# EAGLE design RoboDrum_Final (EAGLE 9.6.2)
AUTHOR: Ward, Turn, Gokhale; BOARD_NAME: FinalDraft; DOC_NUM: 0; PROJECT_NAME: RoboDrum; REVISION: 1
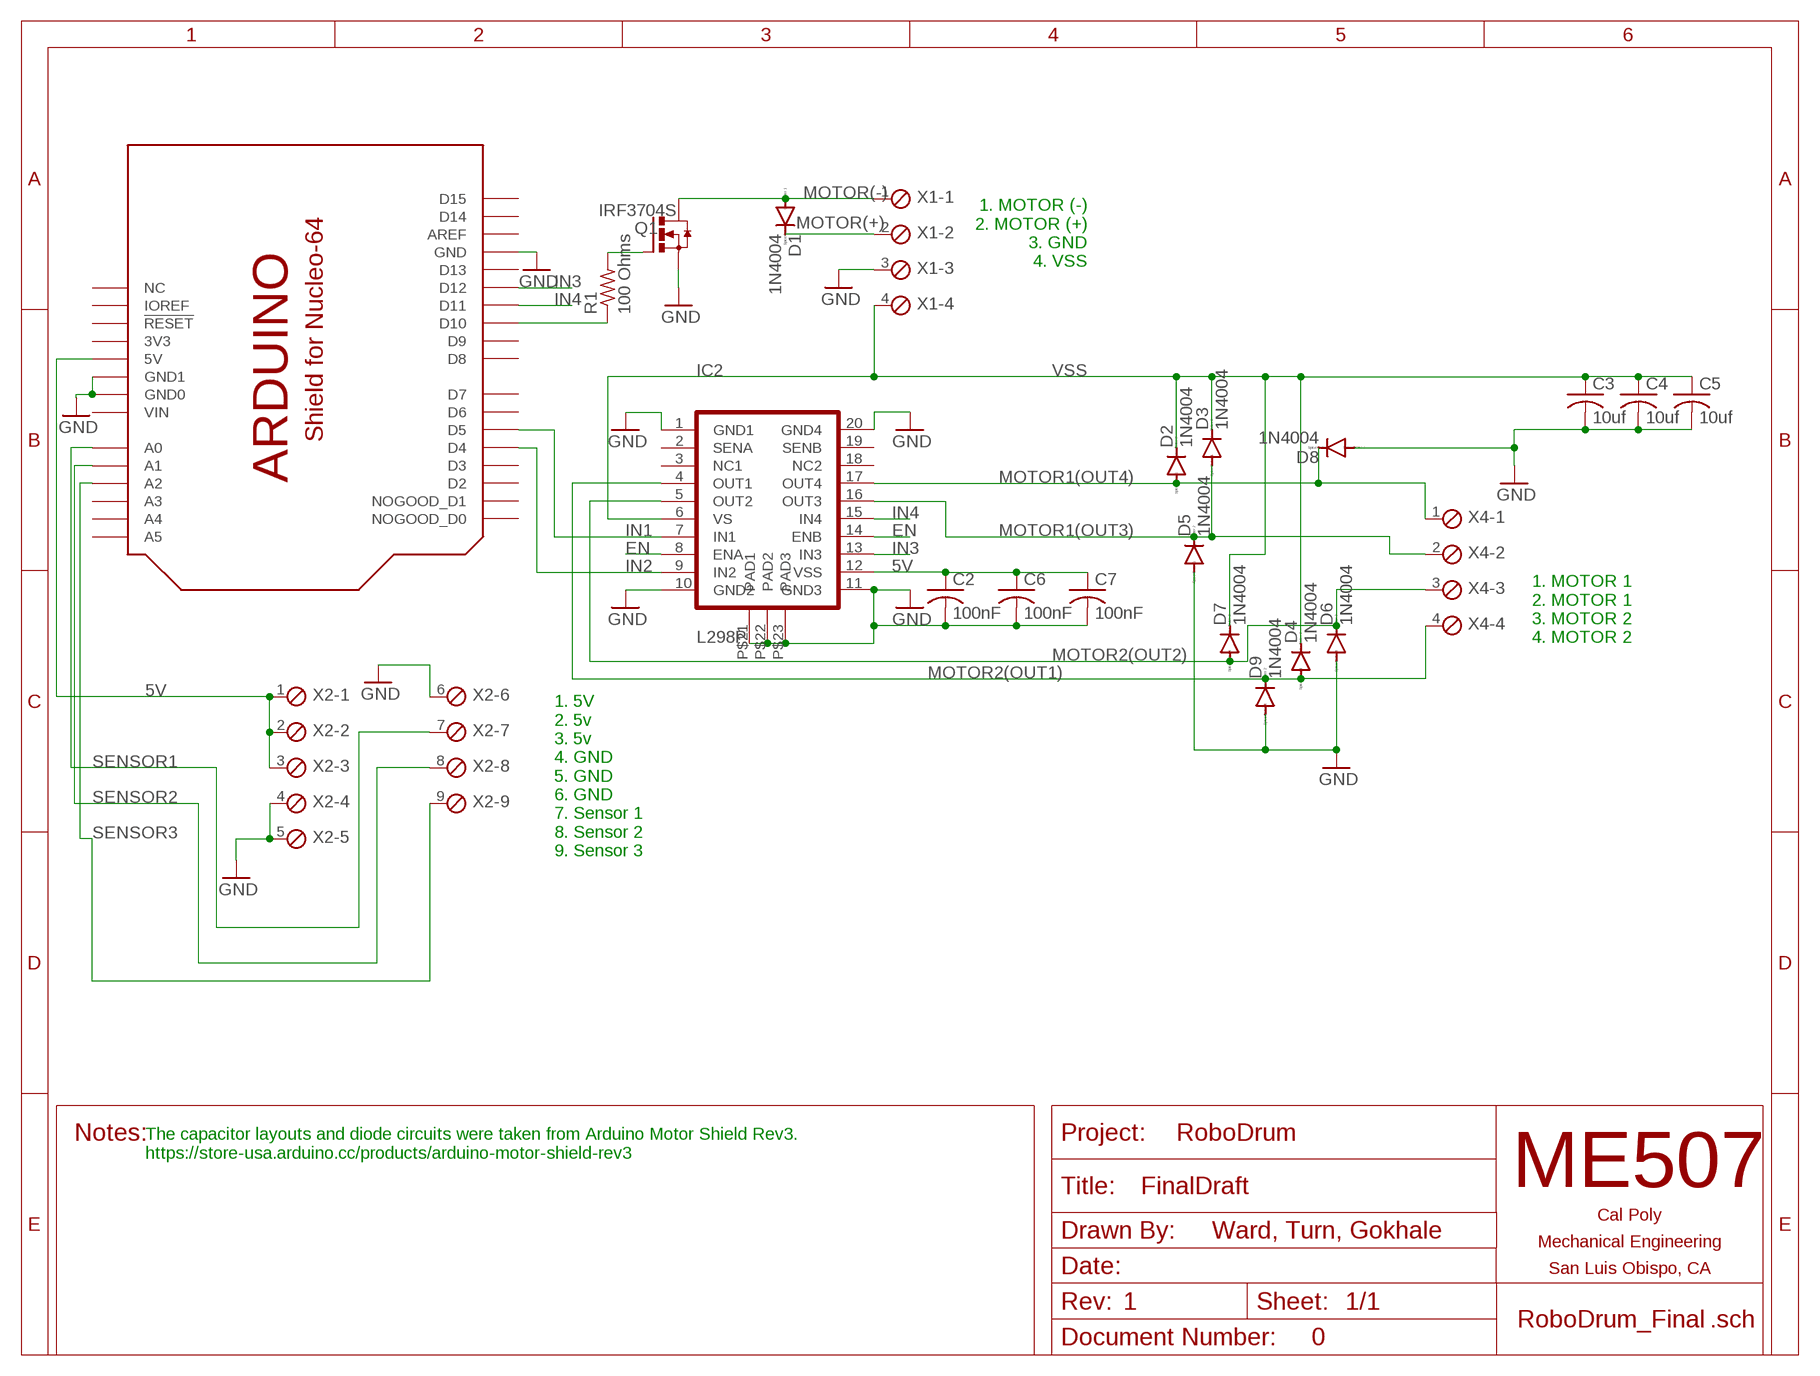
[diagram p0: schematic, sheet 1]

## Parts
C2  100nF  C-USC0805  [C0805]
C3  10uf  C-USC1206  [C1206]
C4  10uf  C-USC1206  [C1206]
C5  10uf  C-USC1206  [C1206]
C6  100nF  C-USC0805  [C0805]
C7  100nF  C-USC0805  [C0805]
D1  1N4004  [DO41-10]
D2  1N4004  [DO41-10]
D3  1N4004  [DO41-10]
D4  1N4004  [DO41-10]
D5  1N4004  [DO41-10]
D6  1N4004  [DO41-10]
D7  1N4004  [DO41-10]
D8  1N4004  [DO41-10]
D9  1N4004  [DO41-10]
IC2  L298P  [POWER-SO20]
Q1  IRF3704S  [D2PACK]
R1  100 Ohms  R-US_M0805  [M0805]
U$1  SHIELD_FOR_NUCLE0_64_STANDARD  [SHIELD_FOR_NUCLEO_64_STD]
X1  SCREWTERM_4P_381  [4POL381]
X2  SCREWTERM_9P_254  [9POL254]
X4  SCREWTERM_4P_254  [4POL254]

## Nets
5V: C2.1 C6.1 C7.1 IC2.P$12(VSS) U$1.5V X2.1 X2.2 X2.3
EN: IC2.P$8(ENA) IC2.P$14(ENB)
GND [Power]: C2.2 C3.2 C4.2 C5.2 C6.2 C7.2 D5.A D6.A D8.A D9.A IC2.P$1(GND1) IC2.P$10(GND2) IC2.P$11(GND3) IC2.P$20(GND4) IC2.P$21(PAD1) IC2.P$22(PAD2) IC2.P$23(PAD3) Q1.3(S) U$1.GND U$1.GND1(GND0) U$1.GND2(GND1) X1.3 X2.4 X2.5 X2.6
IN1: IC2.P$7(IN1) U$1.D5
IN2: IC2.P$9(IN2) U$1.D4
IN3: IC2.P$13(IN3) U$1.D12
IN4: IC2.P$15(IN4) U$1.D11
MOTOR1(OUT3) [Power]: D3.A D5.C IC2.P$16(OUT3) X4.2
MOTOR1(OUT4) [Power]: D2.A D8.C IC2.P$17(OUT4) X4.1
MOTOR2(OUT1) [Power]: D4.A D9.C IC2.P$4(OUT1) X4.4
MOTOR2(OUT2) [Power]: D6.C D7.A IC2.P$5(OUT2) X4.3
MOTOR(+) [Power]: D1.C X1.2
MOTOR(-) [Power]: D1.A Q1.2(D) X1.1
N$8: R1.1 U$1.D10
N$9: Q1.1(G) R1.2
SENSOR1: U$1.A2 X2.9
SENSOR2: U$1.A1 X2.8
SENSOR3: U$1.A0 X2.7
VSS [Power]: C3.1 C4.1 C5.1 D2.C D3.C D4.C D7.C IC2.P$6(VS) X1.4
Unconnected: IC2.P$2(SENA) IC2.P$3(NC1) IC2.P$18(NC2) IC2.P$19(SENB) U$1.A3 U$1.A4 U$1.A5 U$1.AREF U$1.D0(NOGOOD_D0) U$1.D1(NOGOOD_D1) U$1.D2 U$1.D3 U$1.D6 U$1.D7 U$1.D8 U$1.D9 U$1.D13 U$1.D14 U$1.D15 U$1.IOREF U$1.NC U$1.NRST(!RESET)

## Notes on the sheet
- 1. MOTOR (-)
  2. MOTOR (+)
  3. GND
  4. VSS
- 1. MOTOR 1
  2. MOTOR 1
  3. MOTOR 2
  4. MOTOR 2
- 1. 5V
  2. 5v
  3. 5v
  4. GND
  5. GND
  6. GND
  7. Sensor 1
  8. Sensor 2
  9. Sensor 3
- The capacitor layouts and diode circuits were taken from Arduino Motor Shield Rev3. 
  https://store-usa.arduino.cc/products/arduino-motor-shield-rev3

## Power pins joined to a net without a drawn wire
3V3: U$1.3V(3V3)
VIN: U$1.VIN

## Library data of the parts
C2-C7 = rcl:C-US: CAPACITOR, American symbol; SPICEPREFIX: C
D1-D9 = diode:1N4004: DIODE general purpose rectifier, 1 A
IC2 = SmartPrj:L298P: L298P DUAL FUL-BRIDGE DRIVER PowerSO20
Q1 = transistor-power:IRF3704: SMPS MOSFET HEXFET® Power MOSFET Source: http://www.irf.com/product-info/datasheets/data/irf3704.pdf
R1 = rcl:R-US_: RESISTOR, American symbol; SPICEPREFIX: R
U$1 = ME507:SHIELD_FOR_NUCLE0_64: Arduino Style Shield for Nucleo-64 This is a board outline with pin locations for an Arduino style shield which fits on top of an STM32 Nucleo-64. Pin names are generic except for Nucleo specific pins such as IOREF. There are two board sizes, the standard which matches the size of an Arduino Uno, and the short version which can be less expensive to produce if you don't need a lot of board area. The outline is on the DIMENSION layer. When making a new board, you must delete the lines which form the default board outline so that this package's outlines control the dimensions of the board. Pins D0 and D1 are connected to a communications port and are not available for general use, so they are labeled as NOGOOD on the symbol and footprints.
X1 X4 = ME507:SCREWTERM_4P: Screw Terminal Block This part is designed for a screw terminal connector. The 2.54mm (0.100 inch) foorprint can also be used for male or female pin headers such as those on most development boards. One can also solder wires directly into the holes, though this makes modifications or repairs to the system more inconvenient. Larger versions can carry more current.
X2 = ME507:SCREWTERM_9P: Screw Terminal Block This part is designed for a screw terminal connector. The 2.54mm (0.100 inch) foorprint can also be used for male or female pin headers such as those on most development boards. One can also solder wires directly into the holes, though this makes modifications or repairs to the system more inconvenient. Larger versions can carry more current.

## Net classes
0 default: width 0.305 mm, drill 0.635 mm, clearance 0.406 mm
1 Power: width 0.813 mm, drill 0.635 mm, clearance 0.406 mm

## Board
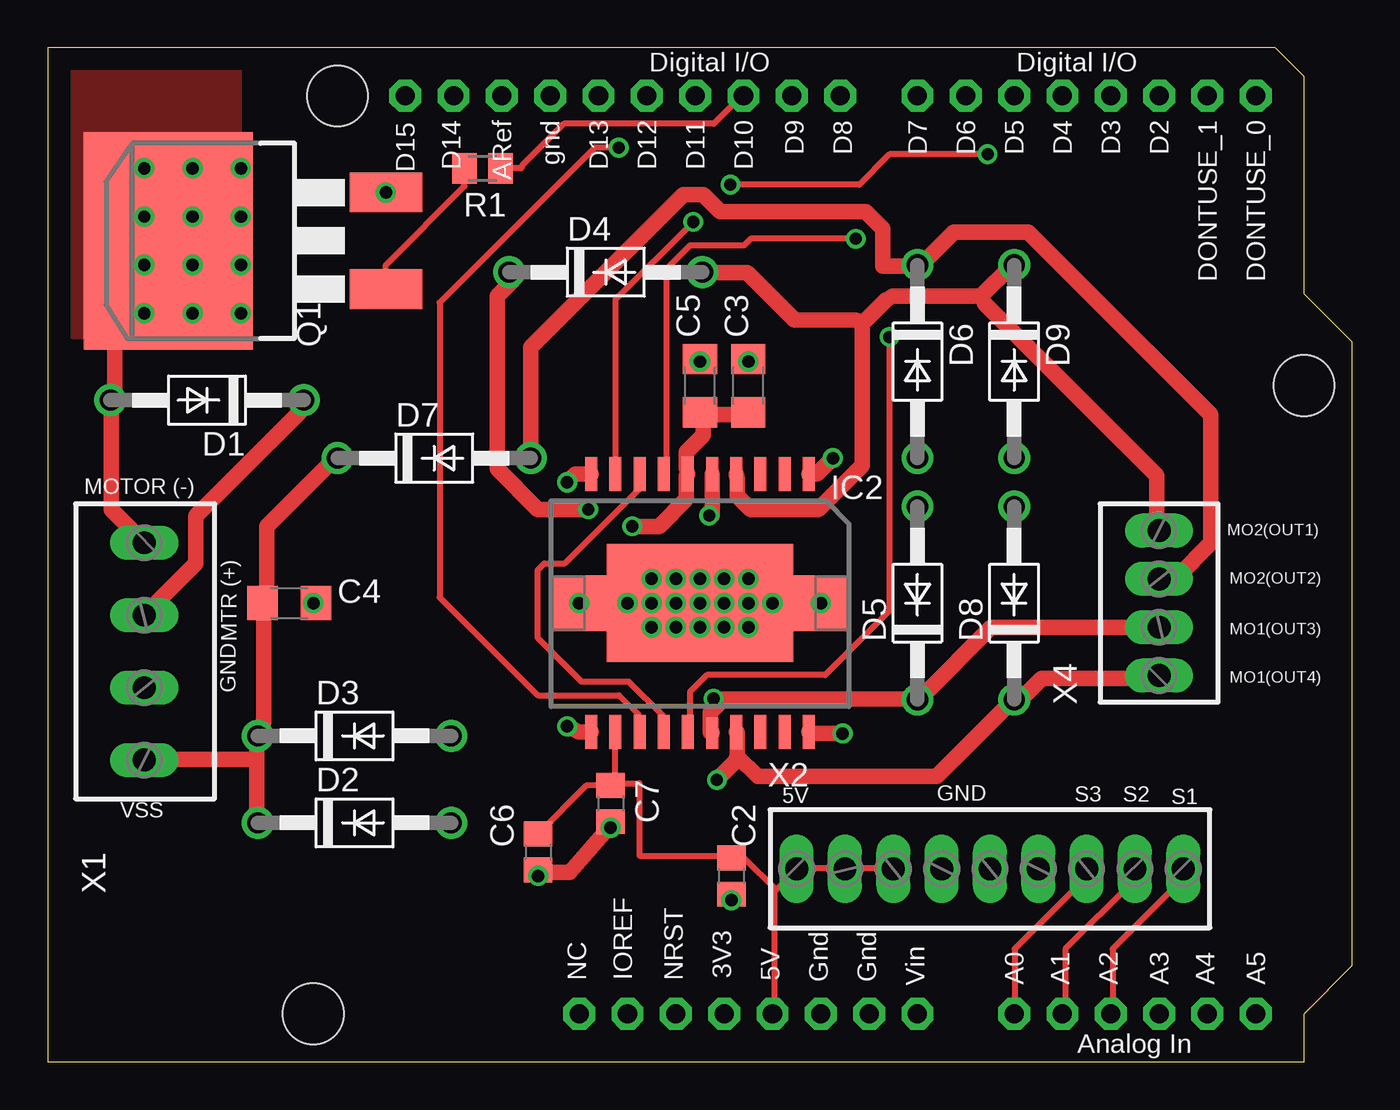
[diagram p1: board, top side]
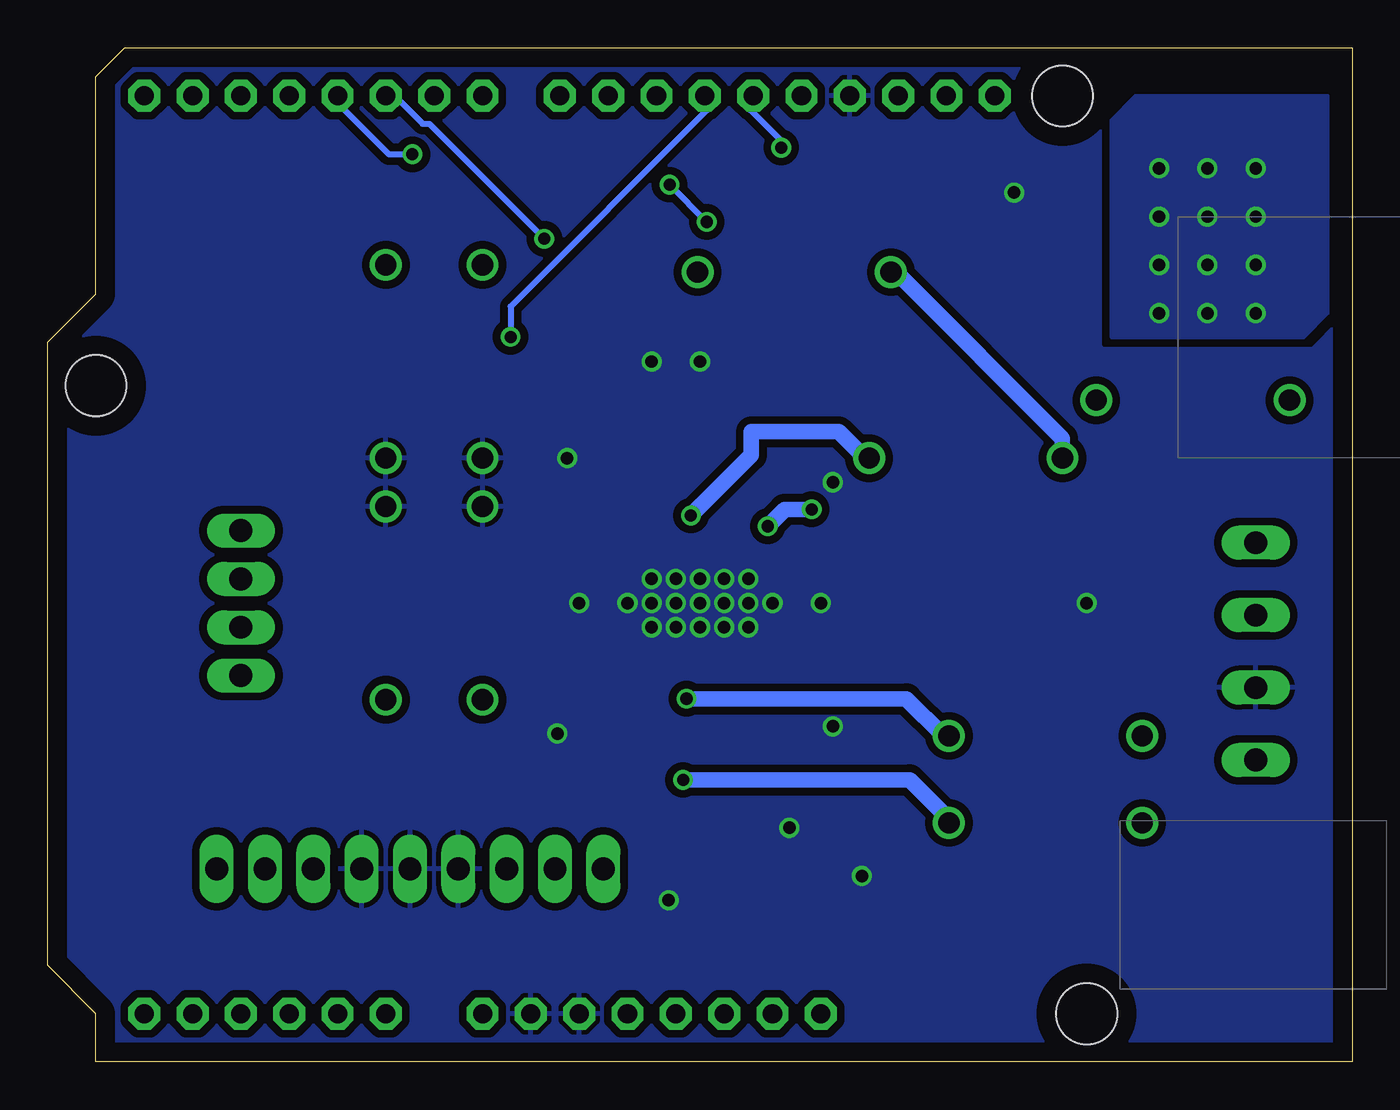
[diagram p2: board, bottom side, seen from below]

Size 68.58 x 53.34 mm. Coordinates in mm from the lower left corner, seen from the top.
Copper layers (1*16): Top 0.035mm / dielectric 1.5mm / Bottom 0.035mm
Design rules "default": minimum track width 6mil, minimum drill 0.35mm, track to track 6mil, track to pad 6mil, pad to pad 6mil, via to via 6mil, smd to smd 6mil, copper to edge 40mil, drill to drill 6mil, minimum pad ring 10mil, minimum via ring 8mil, stop-mask expansion 4mil, vias tented up to drill 0mil, thermal gap 10mil

### Footprints (pad centres in the part's own frame; a part is rotated, then mirrored left to right if it is on the bottom)
C0805 = smd 1.3 x 1.5: 1 -0.95,0; 2 0.95,0
C1206 = smd 1.6 x 1.8: 1 -1.4,0; 2 1.4,0
DO41-10 = drill 1.118: A 5.08,0; C -5.08,0
POWER-SO20 = smd 0.635 x 1.778: P$1 -5.715,-6.782; P$2 -4.445,-6.782; P$3 -3.175,-6.782; P$4 -1.905,-6.782; P$5 -0.635,-6.782; P$6 0.635,-6.782; P$7 1.905,-6.782; P$8 3.175,-6.782; P$9 4.445,-6.782; P$10 5.715,-6.782; P$11 5.715,6.782; P$12 4.445,6.782; P$13 3.175,6.782; P$14 1.905,6.782; P$15 0.635,6.782; P$17 -1.905,6.782; P$18 -3.175,6.782; P$19 -4.445,6.782; P$20 -5.715,6.782 | smd 0.635 x 1.651: P$16 -0.635,6.833 | smd 9.804 x 6.198: P$21 0,0 | smd 3.048 x 2.921: P$22 -6.426,0; P$23 6.426,0
D2PACK = smd 2.083 x 3.81: 1 -2.54,-8.89; 3 2.54,-8.89 | smd 11.43 x 8.89: 2 0,2.54
M0805 = smd 1.3 x 1.6: 1 -0.95,0; 2 0.95,0
SHIELD_FOR_NUCLEO_64_STD = drill 1 pad 1.676 octagon: 3V 35.56,2.54; 5V 38.1,2.54; A0 50.8,2.54; A1 53.34,2.54; A2 55.88,2.54; A3 58.42,2.54; A4 60.96,2.54; A5 63.5,2.54; AREF 23.876,50.8; D0 63.5,50.8; D1 60.96,50.8; D2 58.42,50.8; D3 55.88,50.8; D4 53.34,50.8; D5 50.8,50.8; D6 48.26,50.8; D7 45.72,50.8; D8 41.656,50.8; D9 39.116,50.8; D10 36.576,50.8; D11 34.036,50.8; D12 31.496,50.8; D13 28.956,50.8; D14 21.336,50.8; D15 18.796,50.8; GND 26.416,50.8; GND1 43.18,2.54; GND2 40.64,2.54; IOREF 30.48,2.54; NC 27.94,2.54; NRST 33.02,2.54; VIN 45.72,2.54 | hole 3.2: 15.24,50.8; 66.04,35.56; 13.97,2.54
4POL381 = drill 1.2 long: 1 -5.715,0; 2 -1.905,0; 3 1.905,0; 4 5.715,0
9POL254 = drill 1.2 long: 1 -10.16,0; 2 -7.62,0; 3 -5.08,0; 4 -2.54,0; 5 0,0; 6 2.54,0; 7 5.08,0; 8 7.62,0; 9 10.16,0
4POL254 = drill 1.2 long: 1 -3.81,0; 2 -1.27,0; 3 1.27,0; 4 3.81,0

### Placement (x,y rotation side)
C2  35.94,9.78 270 top
C3  36.83,35.56 90 top
C4  12.7,24.13 0 top
C5  34.29,35.56 90 top
C6  25.78,11.05 270 top
C7  29.59,13.59 270 top
D1  8.38,34.8 180 top
D2  16.13,12.57 0 top
D3  16.13,17.15 0 top
D4  29.34,41.53 0 top
D5  45.72,24.13 90 top
D6  45.72,36.83 270 top
D7  20.32,31.75 0 top
D8  50.8,24.13 90 top
D9  50.8,36.83 270 top
IC2  34.29,24.13 180 top
Q1  8.89,43.18 90 top
R1  22.86,46.99 180 top
U$1  0,0 0 top
X1  5.08,21.59 270 top
X2  49.53,10.16 0 top
X4  58.42,24.13 90 top

### Tracks (layer width: path | path; a pad name or v marks a point on that pad's centre or on a via)
5V
  Top 0.305: C7.1 28.32,14.54 C6.1 | 29.85,14.66 29.67,14.66 C7.1 | 29.85,14.66 31.11,14.66 31.11,10.85 35.94,10.85 C2.1 | 29.85,14.66 IC2.P$12 | 29.85,14.66 C7.1 | C2.1 35.94,10.67 36.47,10.67 C2.1 | 38.29,9.05 39.27,10.03 X2.1 39.45,10.21 41.76,10.21 X2.2 41.94,10.21 44.42,10.21 X2.3 | 38.29,9.05 38.2,8.97 38.2,2.56 U$1.5V | 38.29,9.05 36.6,10.74 C2.1
EN
  Top 0.305: IC2.P$8 31.09,30.84 31.09,30.12 27.18,26.21 26.11,26.21 25.76,25.86 25.76,22.3 28.07,19.99 30.56,19.99 32.33,18.21 32.33,17.5 IC2.P$14
GND  (via drill 0.65)
  Top 0.813: C6.2 25.76,9.98 25.76,9.8 v25.78,9.78 26.11,9.98 27.44,9.98 29.59,12.45 C7.2 | v35.94,8.51 C2.2 | IC2.P$11 27.92,17.35 v27.31,17.65 | IC2.P$20 40.08,17.27 v41.78,17.27 | IC2.P$10 27.74,30.91 v27.31,30.48 | v41.28,31.75 40.44,30.91 IC2.P$1 | v34.29,36.83 C5.2 | C4.2 14.02,24.16 v13.97,24.13 | C3.2 36.7,36.88 v36.83,36.83 | IC2.P$23 27.89,24.08 v27.94,24.13 | IC2.P$22 40.69,24.08 v40.64,24.13
  other vias: 17.78,45.72 29.59,12.32 34.29,24.13 31.75,24.13 33.02,24.13 30.48,24.13 31.75,25.4 33.02,25.4 34.29,25.4 35.56,25.4 36.83,25.4 31.75,22.86 33.02,22.86 34.29,22.86 35.56,22.86 36.83,22.86 38.1,24.13 36.83,24.13 35.56,24.13
  pour Bottom (rank 2): -1.27,54.61 -1.27,0 1.27,-2.54 69.85,-2.54 69.85,57.15 67.31,54.61
IN1  (via drill 0.64)
  Top 0.305: v42.47,43.28 36.96,43.28 36.6,42.93 33.76,42.93 32.51,41.68 32.51,31.01 IC2.P$7
  Bottom 0.305: v42.47,43.28 48.51,49.33 48.87,49.33 50.29,50.75 50.65,50.75 U$1.D5
IN2  (via drill 0.64)
  Top 0.305: v49.4,47.73 44.25,47.73 42.65,46.13 v35.89,46.13 | IC2.P$9 29.85,40.08 v33.93,44.17
  Bottom 0.305: v49.4,47.73 50.65,47.73 53.31,50.39 53.31,50.75 U$1.D4 | v35.89,46.13 v33.93,44.17
IN3  (via drill 0.64)
  Top 0.305: v30.02,48.08 28.75,48.08 20.6,39.93 20.6,24.44 25.76,19.28 30.02,19.28 31.09,18.21 31.09,17.5 IC2.P$13
  Bottom 0.305: v30.02,48.08 30.02,48.44 31.62,50.04 31.62,50.75 U$1.D12
IN4  (via drill 0.64)
  Top 0.305: v44.25,38.12 44.25,23.72 40.87,20.34 34.65,20.34 33.76,19.46 33.76,17.5 IC2.P$15
  Bottom 0.305: v44.25,38.12 44.25,39.73 33.93,50.04 33.93,50.75 U$1.D11
MOTOR1(OUT3)  (via drill 0.64)
  Top 0.813: 35.27,18.83 35.53,19.1 45.67,19.1 D5.C 46.03,19.28 49.58,22.84 58.29,22.84 X4.2 | 35.27,18.83 34.82,18.39 34.82,17.32 IC2.P$16 | v35,19.1 35.27,18.83
  Bottom 0.813: D3.A 21.49,17.15 23.44,19.1 v35,19.1
MOTOR1(OUT4)  (via drill 0.64)
  Top 0.813: 36.25,16.08 36.25,17.32 IC2.P$17 | 36.25,16.08 37.31,15.01 46.74,15.01 50.65,18.92 D8.C 51.18,19.1 52.25,20.17 58.29,20.17 X4.1 | v35.18,14.83 36.07,15.72 36.25,16.08
  Bottom 0.813: v35.18,14.83 23.27,14.83 21.31,12.88 21.31,12.7 D2.A
MOTOR2(OUT1)
  Top 0.813: 49.05,40.26 44.42,40.26 44.07,40.08 42.82,38.84 | 49.05,40.26 50.65,41.86 D9.C | X4.4 58.29,27.99 58.29,30.84 49.22,39.9 49.05,40.26 | 42.82,38.84 42.82,31.37 40.51,29.06 36.96,29.06 36.25,29.77 36.25,30.66 IC2.P$4 | D4.A 34.47,41.5 36.78,41.5 39.27,39.01 42.47,39.01 42.82,38.84
MOTOR2(OUT2)  (via drill 0.64)
  Top 0.813: X4.3 58.47,25.5 59.36,25.5 61.14,27.28 61.14,34.04 51.54,43.64 47.62,43.64 46.03,42.04 D6.C 45.67,41.86 43.89,41.86 43.89,43.82 43,44.7 35.36,44.7 34.47,45.59 33.4,45.59 25.4,37.59 D7.A | IC2.P$5 34.92,28.73 v34.77,28.73
  Bottom 0.813: D7.A 25.4,31.9 25.76,31.9 27,33.15 31.59,33.15 31.59,31.91 v34.77,28.73
MOTOR(+)
  Top 0.813: X1.2 7.8,26.21 7.8,28.7 13.31,34.21 13.31,34.75 D1.C
MOTOR(-)  (via drill 0.65)
  Top 0.813: X1.1 4.95,27.46 3.35,29.06 3.35,34.77 D1.A 3.53,35.13 3.53,38.12 6.55,41.15 Q1.2
  other vias: 5.08,46.99 7.62,46.99 5.08,44.45 5.08,41.91 5.08,39.37 10.16,46.99 7.62,44.45 7.62,41.91 7.62,39.37 10.16,39.37 10.16,41.91 10.16,44.45
  pour Top (isolate 0.254, no thermals): 1.27,52.07 1.27,38.1 10.16,38.1 10.16,52.07
  pour Bottom (isolate 0.254): 12.7,38.1 2.54,38.1 1.27,39.37 1.27,50.8 11.43,50.8 12.7,49.53
N$8
  Top 0.305: R1.1 24.88,46.99 24.96,47.16 27.13,49.33 35,49.33 36.42,50.75 U$1.D10
N$9
  Top 0.305: Q1.1 17.78,41.91 21.91,46.04 R1.2
SENSOR1
  Top 0.305: U$1.A2 55.98,2.56 55.98,5.94 59.54,9.5 59.54,10.03 X2.9
SENSOR2
  Top 0.305: U$1.A1 53.49,2.56 53.49,5.94 57.05,9.5 57.05,10.03 X2.8
SENSOR3
  Top 0.305: U$1.A0 50.83,2.56 50.83,5.94 54.56,9.68 54.56,10.03 X2.7
VSS  (via drill 0.64)
  Top 0.813: v30.73,28.17 32.16,28.17 33.58,29.59 33.58,30.84 IC2.P$6 33.58,31.19 33.58,32.08 34.47,32.97 34.47,33.68 34.65,34.04 C5.1 | 11,15.9 11,17.15 D3.C 11.18,17.5 11.35,17.86 11.35,23.42 C4.1 11.53,24.44 11.53,28.17 15.09,31.73 D7.C | 11,15.9 11,12.7 D2.C | 11,15.9 5.13,15.9 X1.4 | 34.27,34.29 34.29,34.29 C5.1 | v28.42,29.06 25.76,29.06 23.62,31.19 23.62,40.26 24.51,41.15 D4.C | C3.1 36.78,34.04 35,34.04 34.65,34.21 C5.1
  Bottom 0.813: v30.73,28.17 29.85,29.06 v28.42,29.06 | D7.C 15.24,32.79 23.88,41.43 24.23,41.43 D4.C

### Text on the board
tNames: MOTOR (-) | MO2(OUT1) | MTR (+) | MO2(OUT2) | MO1(OUT3) | GND | MO1(OUT4) | S3 | S2 | 5V | GND | S1 | VSS